# EAGLE design ext_rgb_M (EAGLE 9.6.2)
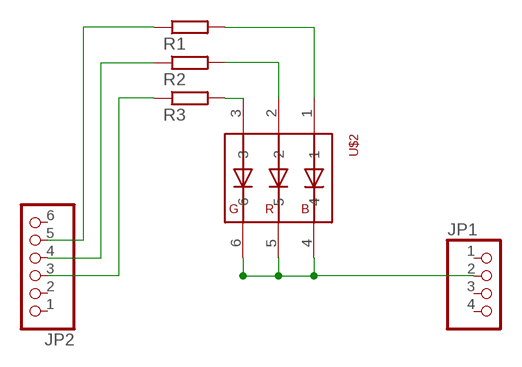
[diagram p0: schematic, sheet 1]

## Parts
JP1  PINHD-1X4  [1X04]
JP2  PINHD-1X6  [1X06]
R1  R-EU_R0603  [R0603]
R2  R-EU_R0603  [R0603]
R3  R-EU_R0603  [R0603]
U$2  RGB_WW-FCE50TC-Q1  [RGB_WW-FCE50TC-Q1]

## Nets
GND: JP1.2 U$2.4 U$2.5 U$2.6
N$1: R1.2 U$2.1
N$2: R3.2 U$2.3
N$3: R2.2 U$2.2
N$4: JP2.5 R1.1
N$5: JP2.4 R2.1
N$6: JP2.3 R3.1
Unconnected: JP1.1 JP1.3 JP1.4 JP2.1 JP2.2 JP2.6

## Library data of the parts
JP1 = pinhead2:PINHD-1X4: PIN HEADER
JP2 = pinhead2:PINHD-1X6: PIN HEADER
R1-R3 = resistor:R-EU_: RESISTOR, European symbol
U$2 = !stavebnice03:RGB_WW-FCE50TC-Q1

## Board
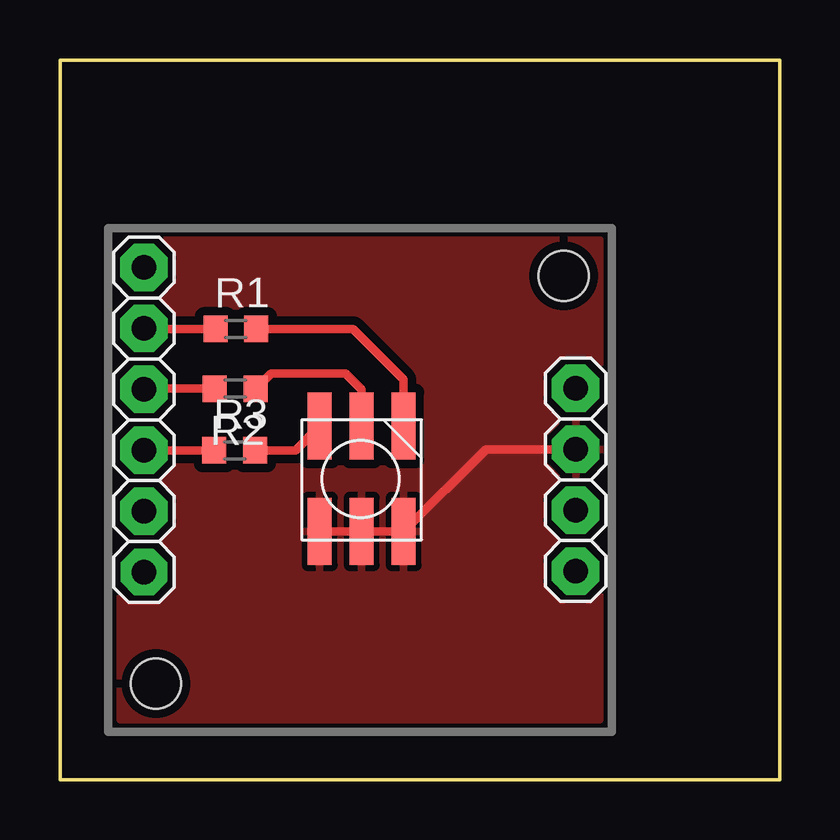
[diagram p1: board, top side]
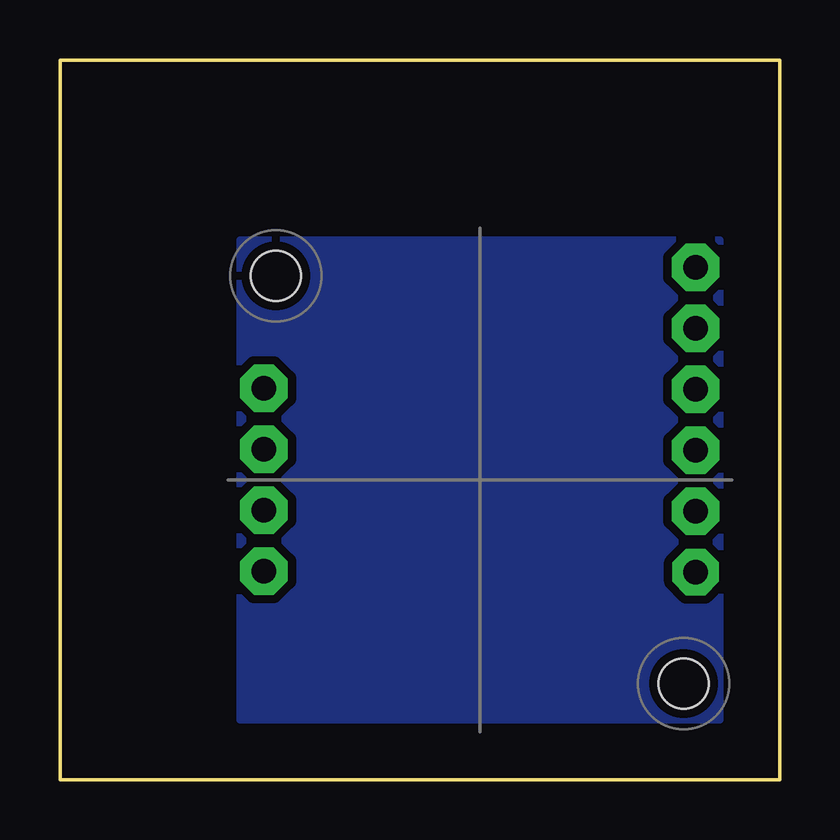
[diagram p2: board, bottom side, seen from below]

Size 30 x 30 mm. Coordinates in mm from the lower left corner, seen from the top.
Outline: 0,0 0,30 30,30 30,0 0,0
Copper layers (1*16): Top 0.035mm / dielectric 1.5mm / Bottom 0.035mm
Design rules "default *": minimum track width 14mil, minimum drill 0.35mm, track to track 14mil, track to pad 13mil, pad to pad 10mil, via to via 14mil, smd to smd 14mil, copper to edge 15mil, drill to drill 15mil, minimum pad ring 10mil, minimum via ring 8mil, stop-mask expansion 4mil, vias tented up to drill 0mil, thermal gap 10mil
Holes 2.1 mm at 4,4 21,21

### Footprints (pad centres in the part's own frame; a part is rotated, then mirrored left to right if it is on the bottom)
1X04 = drill 1.016 pad 1.981 octagon: 1 -3.81,0; 2 -1.27,0; 3 1.27,0; 4 3.81,0
1X06 = drill 1.016 pad 1.93 octagon: 1 -6.35,0 | drill 1.016 pad 1.981 octagon: 2 -3.81,0; 3 -1.27,0; 4 1.27,0; 5 3.81,0; 6 6.35,0
R0603 = smd 1 x 1.1: 1 -0.85,0; 2 0.85,0
RGB_WW-FCE50TC-Q1 = smd 1 x 2.8: 1 -1.778,-2.286; 2 -0.028,-2.286; 3 1.722,-2.286; 4 -1.778,2.114; 5 -0.028,2.114; 6 1.722,2.114

### Placement (x,y rotation side)
JP1  21.5,12.5 270 top
JP2  3.5,15 90 top
R1  7.33,18.78 0 top
R2  7.31,16.3 0 top
R3  7.29,13.73 0 top
U$2  12.55,12.45 180 top

### Tracks (layer width: path | path; a pad name or v marks a point on that pad's centre or on a via)
GND
  Top 0.356: U$2.6 U$2.5 U$2.4 17.76,13.77 JP1.2
  pour Top (isolate 0.305): 2.5,22.5 2.5,2.5 22.5,2.5 22.5,22.5
N$1
  Top 0.356: 14.38,14.79 U$2.1 14.33,16.67 12.22,18.78 R1.2
N$2
  Top 0.356: U$2.3 9.82,13.72 R3.2
N$3
  Top 0.356: U$2.2 12.58,16.26 11.91,16.94 8.79,16.94 R2.2
N$4
  Top 0.356: R1.1 3.53,18.78 JP2.5
N$5
  Top 0.356: R2.1 3.53,16.3 JP2.4
N$6
  Top 0.356: R3.1 JP2.3
VDD
  pour Bottom (isolate 0.305): 2.5,22.5 2.5,2.5 22.5,2.5 22.5,22.5

### Text on the board
bDocu: RGB M.0